# EAGLE schematic schematic (EAGLE 9.6.2)
IGNORE_RENUMBER: TP
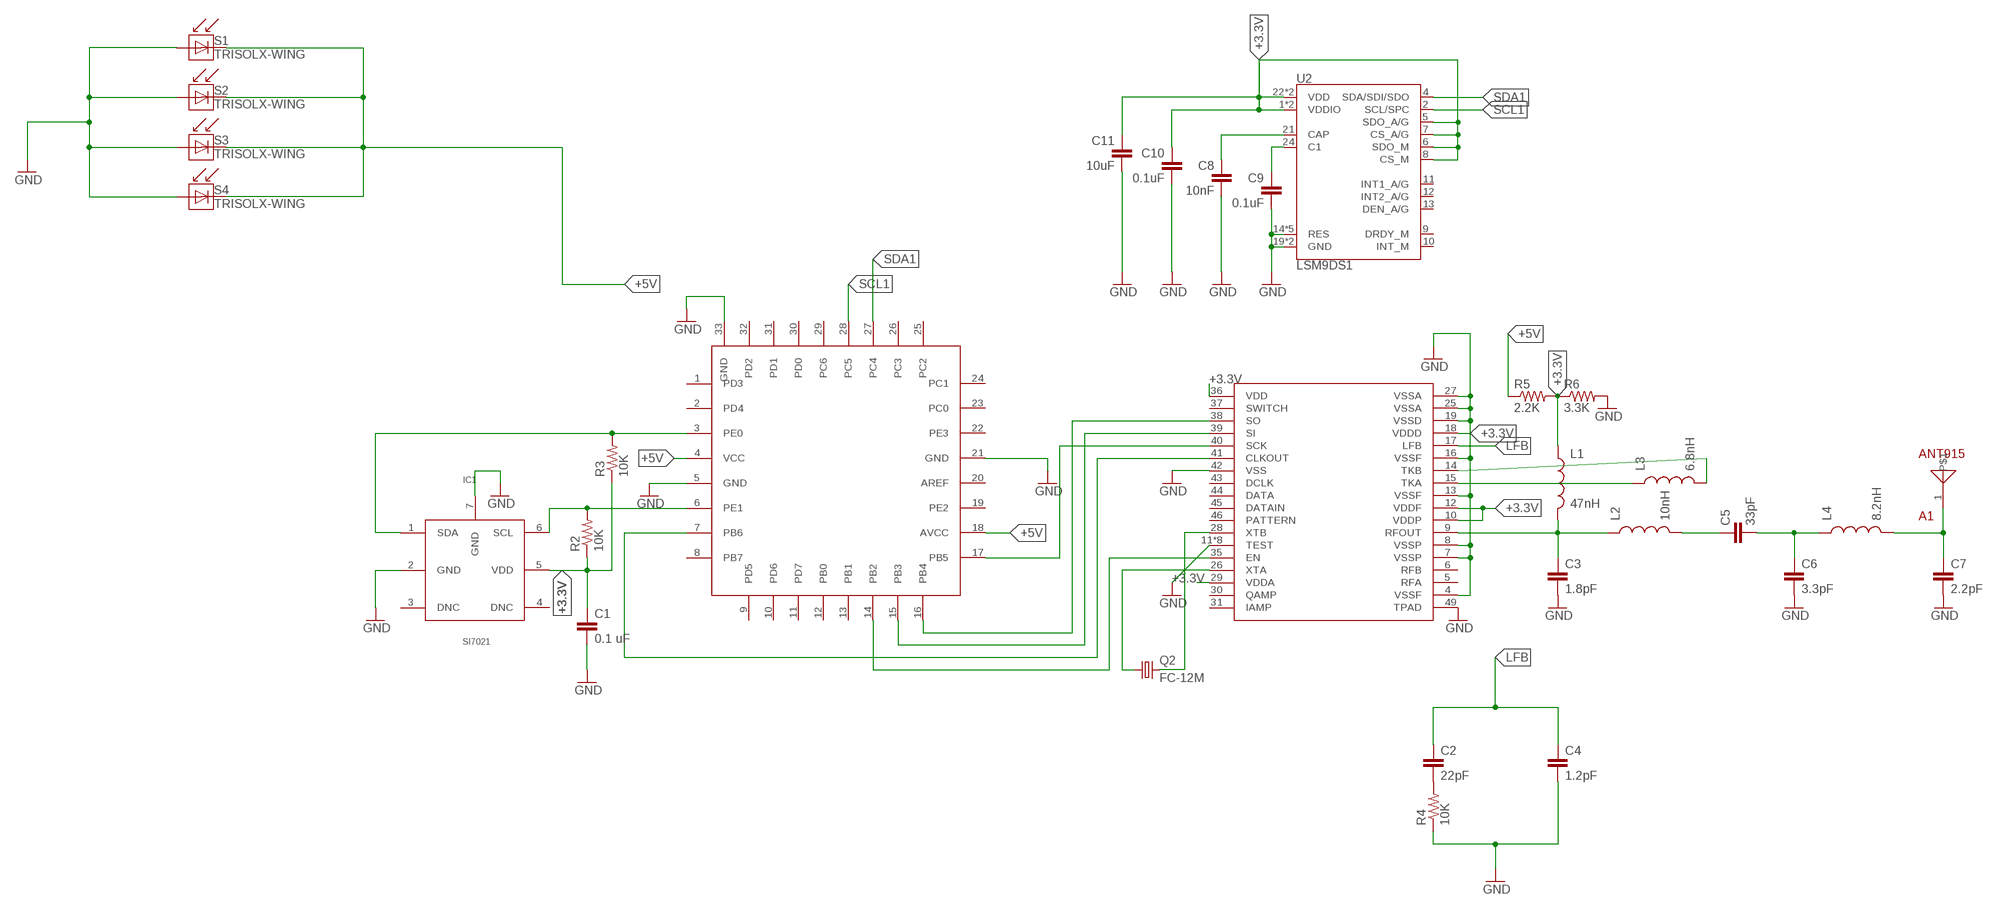
[diagram p0: schematic, sheet 1]

## Parts
A1  ANT915  [ANT915]
C1  0.1 uF  CAP0603-CAP  [0603-CAP]
C2  22pF  CAP0603-CAP  [0603-CAP]
C3  1.8pF  CAP0603-CAP  [0603-CAP]
C4  1.2pF  CAP0603-CAP  [0603-CAP]
C5  33pF  CAP0603-CAP  [0603-CAP]
C6  3.3pF  CAP0603-CAP  [0603-CAP]
C7  2.2pF  CAP0603-CAP  [0603-CAP]
C8  10nF  CAP0603-CAP  [0603-CAP]
C9  0.1uF  CAP0603-CAP  [0603-CAP]
C10  0.1uF  CAP0603-CAP  [0603-CAP]
C11  10uF  CAP0603-CAP  [0603-CAP]
IC1  SI7021  [SI7021]
IC2  ATMEGA328-PB  [ATMEGA328-PB]
IC3  XE1203F  [XE1203F]
L1  47nH  INDUCTOR0603  [0603]
L2  10nH  INDUCTOR0603  [0603]
L3  6.8nH  INDUCTOR0603  [0603]
L4  8.2nH  INDUCTOR0603  [0603]
Q2  FC-12M  [FC-12M]
R2  10K  RESISTOR0603-RES  [0603-RES]
R3  10K  RESISTOR0603-RES  [0603-RES]
R4  10K  RESISTOR0603-RES  [0603-RES]
R5  2.2K  RESISTOR0603-RES  [0603-RES]
R6  3.3K  RESISTOR0603-RES  [0603-RES]
S1  TRISOLX-WING  [TRISOLX-T01]
S2  TRISOLX-WING  [TRISOLX-T01]
S3  TRISOLX-WING  [TRISOLX-T01]
S4  TRISOLX-WING  [TRISOLX-T01]
U2  LSM9DS1  [LGA24-8X4]

## Nets
+3.3V: C1.1 C10.1 C11.1 IC1.5(VDD) IC3.10(VDDP) IC3.12(VDDF) IC3.18(VDDD) IC3.29(VDDA) IC3.36(VDD) L1.1 R2.1 R3.1 R5.2 R6.1 U2.1(VDDIO) U2.3(VDDIO) U2.5(SDO_A/G) U2.6(SDO_M) U2.7(CS_A/G) U2.8(CS_M) U2.22(VDD) U2.23(VDD)
+5V: IC2.4(VCC) IC2.18(AVCC) R5.1 S1.P$2(C) S2.P$2(C) S3.P$2(C) S4.P$2(C)
GND: C1.2 C3.2 C4.2 C6.2 C7.2 C8.2 C9.2 C10.2 C11.2 IC1.2(GND) IC1.7(GND) IC2.5(GND) IC2.21(GND) IC2.33(GND) IC3.4(VSSF) IC3.7(VSSP) IC3.8(VSSP) IC3.11(TEST) IC3.13(VSSF) IC3.16(VSSF) IC3.19(VSSD) IC3.20(TEST) IC3.21(TEST) IC3.23(TEST) IC3.24(TEST) IC3.25(VSSA) IC3.27(VSSA) IC3.32(TEST) IC3.33(TEST) IC3.34(TEST) IC3.42(VSS) IC3.49(TPAD) R4.1 R6.2 S1.P$3(A) S2.P$3(A) S3.P$3(A) S4.P$3(A) U2.14(RES) U2.15(RES) U2.16(RES) U2.17(RES) U2.18(RES) U2.19(GND) U2.20(GND)
LFB: C2.1 C4.1 IC3.17(LFB)
N$1: C2.2 R4.2
N$2: C3.1 IC3.9(RFOUT) L1.2 L2.1
N$3: IC2.7(PB6) IC3.41(CLKOUT)
N$4: C5.1 L2.2
N$5: IC2.14(PB2) IC3.35(EN)
N$6: C5.2 C6.1 L4.1
N$7: A1.1 C7.1 L4.2
N$8: C8.1 U2.21(CAP)
N$10: IC3.15(TKA) L3.1
N$11: IC3.14(TKB) L3.2
N$12: IC3.26(XTA) Q2.1
N$13: IC3.28(XTB) Q2.2
N$14: IC2.15(PB3) IC3.39(SI)
N$15: IC2.16(PB4) IC3.38(SO)
N$16: IC2.17(PB5) IC3.40(SCK)
N$17: C9.1 U2.24(C1)
SCL: IC1.6(SCL) IC2.6(PE1) R2.2
SCL1: IC2.28(PC5) U2.2(SCL/SPC)
SDA: IC1.1(SDA) IC2.3(PE0) R3.2
SDA1: IC2.27(PC4) U2.4(SDA/SDI/SDO)
Unconnected: IC1.3(DNC) IC1.4(DNC) IC2.1(PD3) IC2.2(PD4) IC2.8(PB7) IC2.9(PD5) IC2.10(PD6) IC2.11(PD7) IC2.12(PB0) IC2.13(PB1) IC2.19(PE2) IC2.20(AREF) IC2.22(PE3) IC2.23(PC0) IC2.24(PC1) IC2.25(PC2) IC2.26(PC3) IC2.29(PC6) IC2.30(PD0) IC2.31(PD1) IC2.32(PD2) IC3.5(RFA) IC3.6(RFB) IC3.30(QAMP) IC3.31(IAMP) IC3.37(SWITCH) IC3.43(DCLK) IC3.44(DATA) IC3.45(DATAIN) IC3.46(PATTERN) U2.9(DRDY_M) U2.10(INT_M) U2.11(INT1_A/G) U2.12(INT2_A/G) U2.13(DEN_A/G)

## Library data of the parts
A1 = Mini-Project:ANT915
C1-C11 = SparkFun:CAP: Capacitor Standard 0603 ceramic capacitor, and 0.1" leaded capacitor.
IC1 = Mini-Project:SI7021
IC2 = Mini-Project:ATMEGA328-PB
IC3 = Mini-Project:XE1203F
L1-L4 = SparkFun:INDUCTOR: Inductors Basic Inductor/Choke - 0603 and 1206. Footprints are not proven and vary greatly between part numbers.
Q2 = crystal:FC-12M: kHz RANGE CRYSTAL UNIT LOW PROFILE SMD Source: Epson Toyocom FC-12M.pdf
R2-R6 = SparkFun:RESISTOR: Resistor Basic schematic elements and footprints for 0603, 1206, and PTH resistors.
S1-S4 = TriSolX_QzQube:TRISOLX-WING
U2 = LSM9DS1:LSM9DS1: LSM9DS1 3D accelerometer, gyroscope & magnetometer The LSM9DS1 is a system-in-package featuring a 3D digital linear acceleration sensor, a 3D digital angular rate sensor, and a 3D digital magnetic sensor. The LSM9DS1 has a linear acceleration full scale of ±2g/±4g/±8/±16 g, a magnetic field full scale of ±4/±8/±12/±16 gauss and an angular rate of ±245/±500/±2000 dps. The LSM9DS1 includes an I2 C serial bus interface supporting standard and fast mode (100 kHz and 400 kHz) and an SPI serial standard interface. Magnetic, accelerometer and gyroscope sensing can be enabled or set in power-down mode separately for smart power management. The LSM9DS1 is available in a plastic land grid array package (LGA) and it is guaranteed to operate over an extended temperature range from -40 °C to +85 °C.; PROD_ID: IC-12536